# EAGLE design pepperbacon (EAGLE 5.11)
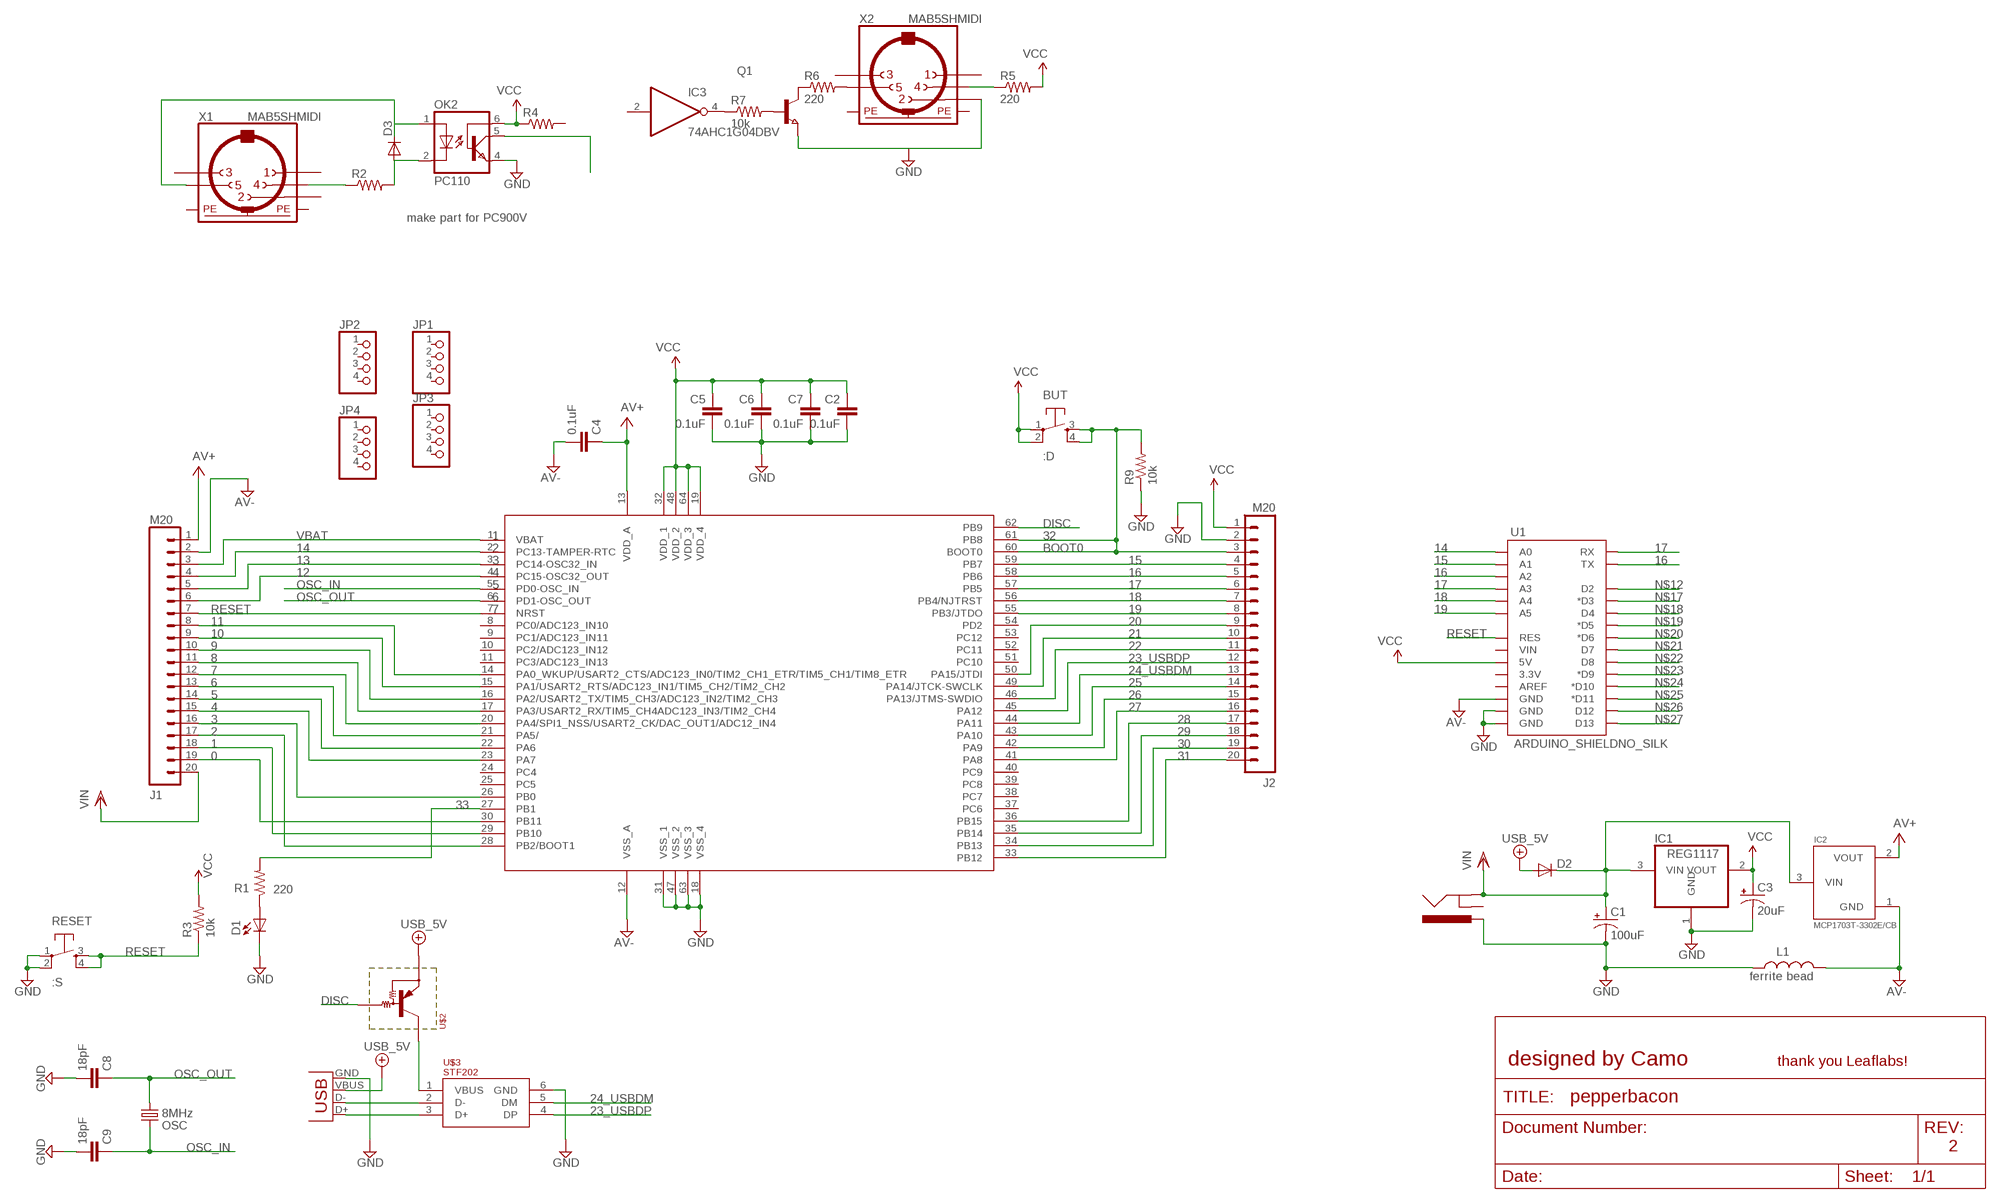
[diagram p0: schematic, sheet 1]

## Parts
BUT  :D  TAC_SWITCHPTH  [TACTILE-PTH]
C1  100uF  CAP_POLPTH2  [CPOL-RADIAL-10UF-25V]
C2  0.1uF  CAP0603  [0603]
C3  20uF  CAP_POLPTH2  [CPOL-RADIAL-10UF-25V]
C4  0.1uF  CAP0603  [0603]
C5  0.1uF  CAP0603  [0603]
C6  0.1uF  CAP0603  [0603]
C7  0.1uF  CAP0603  [0603]
C8  18pF  CAP0603  [0603]
C9  18pF  CAP0603  [0603]
D1  Blue  LED3MM  [LED3MM]
D2  DIODE1N4148  [DIODE-1N4148]
D3  DIODEPTH2  [DOIDE-1N4148]
IC1  REG1117  [SOT223]
IC2  MCP1703T-3302E/CB  MCP1700T  [SOT23]
IC3  74AHC1G04DBV  [SOT23-5]
J1  M20  [1X20]
J2  M20  [1X20]
J3  POWER_JACKPTH  [POWER_JACK_PTH]
JP1  PINHD-1X4  [1X04]
JP2  PINHD-1X4  [1X04]
JP3  PINHD-1X4  [1X04]
JP4  PINHD-1X4  [1X04]
L1  ferrite bead  INDUCTOR0603  [0603]
OK2  PC110  [DIL06]
OSC  8MHz  CRYSTALSMD  [HC49UP]
Q1  NPN-TRANSISTOR_SOT23  [SOT23]
R1  220  RESISTOR0603  [0603]
R2  R-US_R0603  [R0603]
R3  10k  RESISTOR0603  [0603]
R4  R-US_R0603  [R0603]
R5  220  R-US_R0603  [R0603]
R6  220  R-US_R0603  [R0603]
R7  10k  R-US_R0603  [R0603]
R9  10k  RESISTOR0603  [0603]
RESET  :S  TAC_SWITCHPTH  [TACTILE-PTH]
U1  ARDUINO_SHIELDNO_SILK  [DUEMILANOVE_VIAS]
U2  STM32F10XRXT6  [LQFP64]
U$2  PDTA114E  [SOT23]
U$3  STF202  [SOT23-6L]
USB-B  USB-MINIB  USBPTH  [USB-B-PTH]
X1  MAB5SHMIDI  [MIDIFREE]
X2  MAB5SHMIDI  [MIDIFREE]

## Nets
0: J1.19 U2.30(PB11)
1: J1.18 U2.29(PB10)
2: J1.17 U2.28(PB2/BOOT1)
3: J1.16 U2.26(PB0)
4: J1.15 U2.23(PA7)
5: J1.14 U2.22(PA6)
6: J1.13 U2.21(PA5/)
7: J1.12 U2.20(PA4/SPI1_NSS/USART2_CK/DAC_OUT1/ADC12_IN4)
8: J1.11 U2.17(PA3/USART2_RX/TIM5_CH4ADC123_IN3/TIM2_CH4)
9: J1.10 U2.16(PA2/USART2_TX/TIM5_CH3/ADC123_IN2/TIM2_CH3)
10: J1.9 U2.15(PA1/USART2_RTS/ADC123_IN1/TIM5_CH2/TIM2_CH2)
11: J1.8 U2.14(PA0_WKUP/USART2_CTS/ADC123_IN0/TIM2_CH1_ETR/TIM5_CH1/TIM8_ETR)
12: J1.6 U2.4(PC15-OSC32_OUT)
13: J1.5 U2.3(PC14-OSC32_IN)
14: J1.4 U1.A0 U2.2(PC13-TAMPER-RTC)
15: J2.4 U1.A1 U2.59(PB7)
16: J2.5 U1.A2 U1.TX U2.58(PB6)
17: J2.6 U1.A3 U1.RX U2.57(PB5)
18: J2.7 U1.A4 U2.56(PB4/NJTRST)
19: J2.8 U1.A5 U2.55(PB3/JTDO)
20: J2.9 U2.50(PA15/JTDI)
21: J2.10 U2.49(PA14/JTCK-SWCLK)
22: J2.11 U2.46(PA13/JTMS-SWDIO)
23_USBDP: J2.12 U2.45(PA12) U$3.4(DP)
24_USBDM: J2.13 U2.44(PA11) U$3.5(DM)
25: J2.14 U2.43(PA10)
26: J2.15 U2.42(PA9)
27: J2.16 U2.41(PA8)
28: J2.17 U2.36(PB15)
29: J2.18 U2.35(PB14)
30: J2.19 U2.34(PB13)
31: J2.20 U2.33(PB12)
32: BUT.3 BUT.4 J2.3 R9.2 U2.60(BOOT0) U2.61(PB8)
33: R1.2 U2.27(PB1)
+5V/2: D2.A U$2.2(C) USB-B.VBUS ; supply symbol labelled USB_5V
AGND: U1.GND@2(GND) U2.12(VSS_A) ; supply symbol labelled AV-
AV+: C4.1 IC2.2(VOUT) J1.1 U2.13(VDD_A)
AV-: C4.2 IC2.1(GND) J1.2 L1.1
DGND: C1.2(-) C2.2 C3.2(-) C5.2 C6.2 C7.2 C8.2 C9.2 D1.K(C) IC1.1(GND) J2.2 J3.PWR L1.2 OK2.4(EMI) Q1.2(E) R9.1 RESET.1 RESET.2 U1.GND@0(GND) U1.GND@1(GND) U2.18(VSS_4) U2.31(VSS_1) U2.47(VSS_2) U2.63(VSS_3) U$3.6(GND) USB-B.GND X2.2 ; supply symbol labelled GND
DISC: U2.62(PB9) U$2.1(B)
N$2: D1.A R1.1
N$4: R2.1 X1.4
N$5: U$2.3(E) U$3.1(VBUS)
N$6: D3.A OK2.2(C) R2.2
N$7: D3.C OK2.1(A) X1.5
N$8: OK2.5(COL)
N$9: R5.1 X2.4
N$10: R6.2 X2.5
N$11: Q1.3(C) R6.1
N$12: U1.D2
N$13: Q1.1(B) R7.2
N$14: IC3.4(O) R7.1
N$17: U1.D3(*D3)
N$18: U1.D4
N$19: U1.D5(*D5)
N$20: U1.D6(*D6)
N$21: U1.D7
N$22: U1.D8
N$23: U1.D9(*D9)
N$24: U1.D10(*D10)
N$25: U1.D11(*D11)
N$26: U1.D12
N$27: U1.D13
N$59: U$3.2(D-) USB-B.D-
N$60: U$3.3(D+) USB-B.D+
OSC_IN: C9.1 OSC.2 U2.5(PD0-OSC_IN)
OSC_OUT: C8.1 OSC.1 U2.6(PD1-OSC_OUT)
RESET: J1.7 R3.1 RESET.3 RESET.4 U1.RES U2.7(NRST)
VBAT: J1.3 U2.1(VBAT)
VCC: BUT.1 BUT.2 C2.1 C3.1(+) C5.1 C6.1 C7.1 IC1.2(VOUT) J2.1 OK2.6(BAS) R3.2 R4.1 R5.2 U1.5V U2.19(VDD_4) U2.32(VDD_1) U2.48(VDD_2) U2.64(VDD_3)
VIN: C1.1(+) D2.C IC1.3(VIN) IC2.3(VIN) J1.20 J3.GND
Unconnected: IC3.2(I) J3.GNDBREAK JP1.1 JP1.2 JP1.3 JP1.4 JP2.1 JP2.2 JP2.3 JP2.4 JP3.1 JP3.2 JP3.3 JP3.4 JP4.1 JP4.2 JP4.3 JP4.4 R4.2 U1.3.3V U1.AREF U1.VIN U2.8(PC0/ADC123_IN10) U2.9(PC1/ADC123_IN11) U2.10(PC2/ADC123_IN12) U2.11(PC3/ADC123_IN13) U2.24(PC4) U2.25(PC5) U2.37(PC6) U2.38(PC7) U2.39(PC8) U2.40(PC9) U2.51(PC10) U2.52(PC11) U2.53(PC12) U2.54(PD2) X1.1 X1.2 X1.3 X1.PE1(PE) X1.PE2(PE) X2.1 X2.3 X2.PE1(PE) X2.PE2(PE)

## Notes on the sheet
- make part for PC900V
- BOOT0
- designed by Camo | thank you Leaflabs!
- 2

## Power pins joined to a net without a drawn wire
GND: IC3.3(GND)
VCC: IC3.5(VCC)

## Library data of the parts
BUT RESET = 3d2011:TAC_SWITCH: Momentary Switch Button commonly used for reset or general input. Spark Fun Electronics SKU : COM-00097
C1 C3 = SparkFun3:CAP_POL: Capacitor Polarized These are standard SMD and PTH capacitors. Normally 10uF, 47uF, and 100uF in electrolytic and tantalum varieties. Always verify the external diameter of the through hole cap, it varies with capacity, voltage, and manufacturer. The EIA devices should be standard.
C2 C4-C9 = SparkFun:CAP: Capacitor Standard 0603 ceramic capacitor, and 0.1" leaded capacitor.
D1 = SparkFun:LED: LEDs Standard schematic elements and footprints for 5mm, 3mm, 1206, and 0603 sized LEDs. 5mm - Spark Fun Electronics SKU : COM-00529 (and others)
D2 = SparkFun3:DIODE: Diode These are standard reverse protection diodes and small signal diodes. SMA package can handle up to about 1A. SOD-323 can handle about 200mA. What the SOD-323 package when ordering, there are some mfgs out there that are 5-pin packages.
D3 = 3d2011:DIODE: Diode These are standard reverse protection diodes and small signal diodes. SMA package can handle up to about 1A. SOD-323 can handle about 200mA. What the SOD-323 package when ordering, there are some mfgs out there that are 5-pin packages.
IC1 = burr-brown:REG1117: 800mA and 1A Low Dropout (LDO) Positive Regulator 1.8V, 2.5V, 2.85V, 3.3V, 5V, and Adj; MPN: REG1117; OC_FARNELL: 1097566; OC_NEWARK: 14P6981
IC2 = okie:MCP1700T
IC3 = 74xx-little-us:74*1G04: INVERTER Gate
J1 J2 = SparkFun3:M20: This is just like the LOCK variant in that the holes are staggared by 5 mil, but except for the last two holes. They are not altered from the "standard" footprint layout. This is used for a special purpose on the layout of our Graphic LCD Backpack. Make sure you want to use this device before selecting it for you project!
J3 = 3d2011:POWER_JACK: Power Jack This is the standard 5.5mm barrel jack for power. The PTH is the most common, proven, reliable, footprint. All others are experimental. The Slot footprint only works if the mill layer is transmitted to the PCB fab house so be warned. Spark Fun Electronics SKU : PRT-00119. Mating wall wart : TOL-00298 (and others)
JP1-JP4 = 3d2011:PINHD-1X4: PIN HEADER
L1 = SparkFun3:INDUCTOR: Inductors Basic Inductor/Choke - 0603 and 1206. Footprints are not proven and vary greatly between part numbers.
OK2 = optocoupler:PC110: SHARP OPTO COUPLER
OSC = SparkFun2:CRYSTAL: Crystals Various standard crystals. Proven footprints. Spark Fun Electronics SKU : COM-00534
Q1 = semicon-smd-ipc:NPN-TRANSISTOR_: NPN TRANSISTOR
R1 R3 R9 = SparkFun:RESISTOR: Resistor Basic schematic elements and footprints for 0603, 1206, and PTH 1/10th watt (small) resistors.
R2 R4-R7 = resistor:R-US_: RESISTOR, American symbol
U1 = SparkFun:ARDUINO_SHIELD
U2 = stm32:STM32F10XRXT6: STM32F101/103 64pin LQFP
U$2 = bacon:PDTA114E: Transistor with matching resistors (pre biased). Digikey #568-8088-1-ND
U$3 = bacon:STF202: The STF202 is a combination EMI filter and line termination device with integrated TVS diodes for use on upstream USB ports. Digikey Part #STF202-22T1GOSCT-ND
USB-B = SparkFun2:USB: USB Connectors USB-B-PTH is fully proven SKU : PRT-00139 USB-miniB is fully proven SKU : PRT-00587 USB-A-PCB is untested. USB-A-H is throughly reviewed, but untested. Spark Fun Electronics SKU : PRT-00437 USB-B-SMT is throughly reviewed, but untested. Needs silkscreen touching up. USB-A-S has not been used/tested USB-MB-H has not been used/tested
X1 X2 = 3d2011:MAB5SH: Female CONNECTOR 5 pins 90 deg. with shield, horizontal (DIN 41524)

## Net classes
1 vcc: width 0.254 mm

## Board
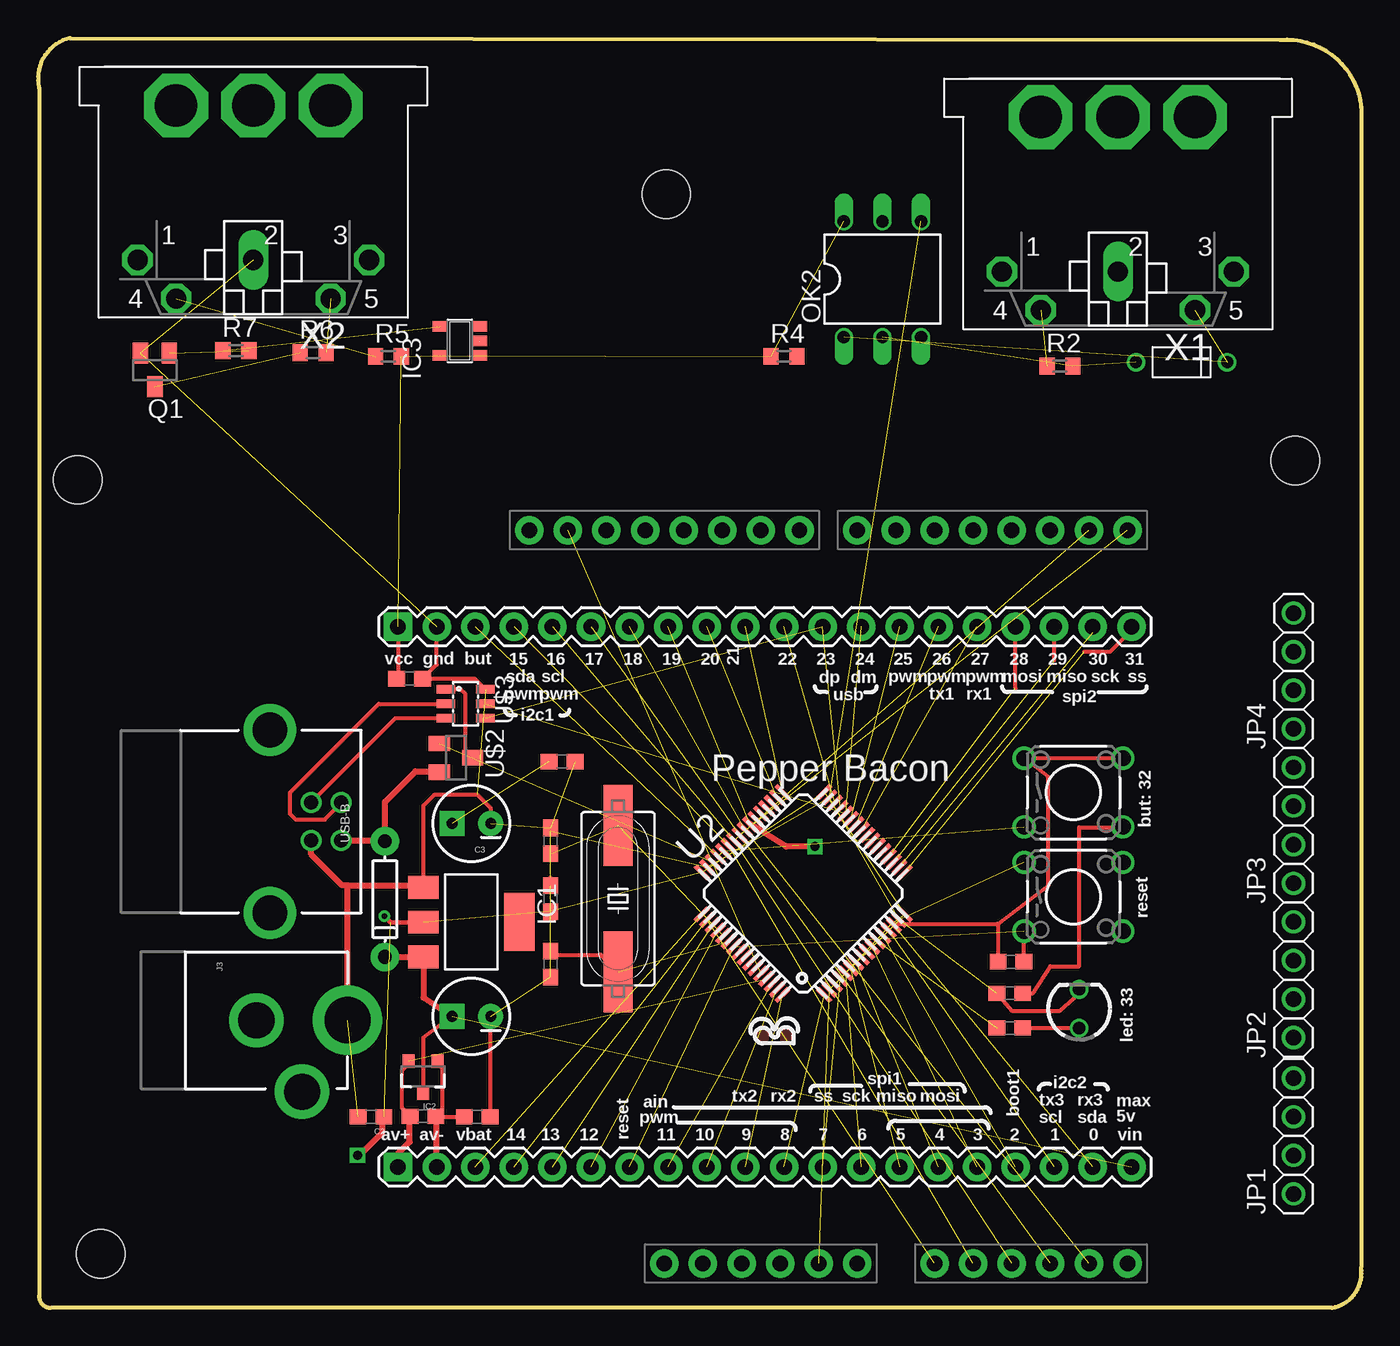
[diagram p1: board, top side]
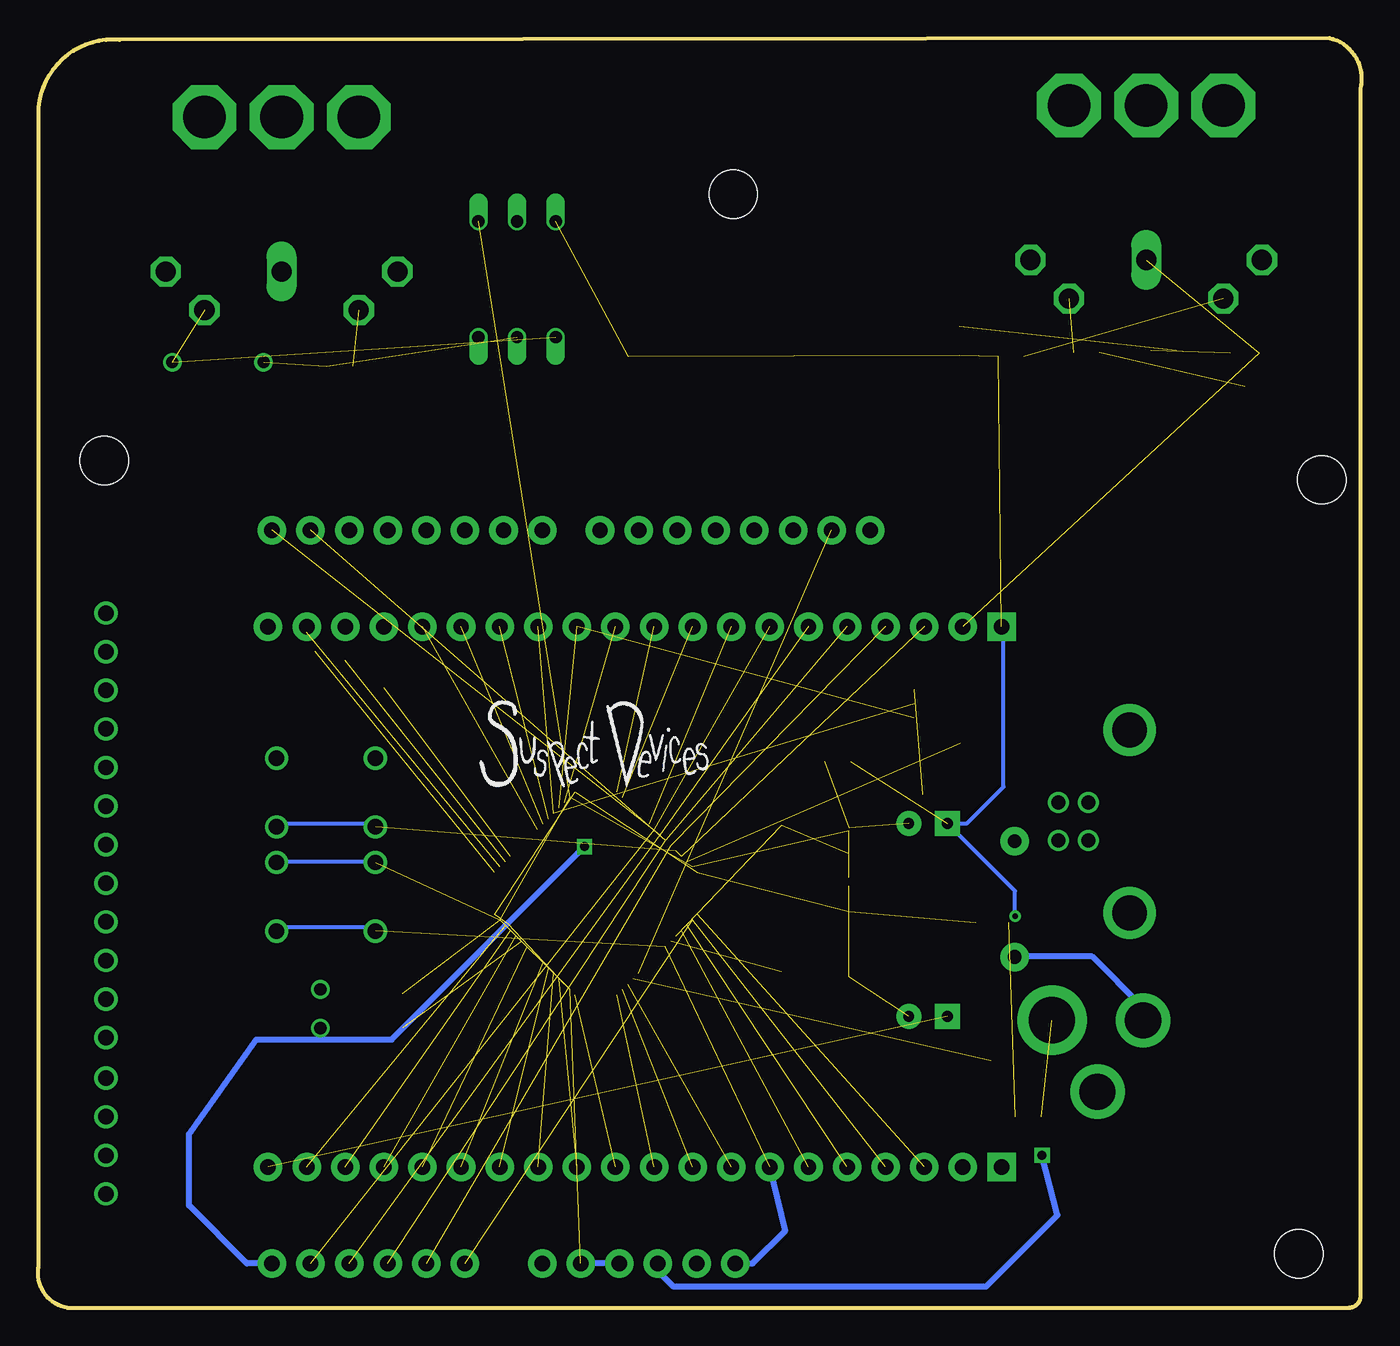
[diagram p2: board, bottom side, seen from below]

Size 87.1 x 83.57 mm. Coordinates in mm from the lower left corner, seen from the top.
Outline: 2.1,83.57 81.73,83.44 arc-90 87.07,78.99 87.07,2.67 arc-90 85.16,0 0.83,0 arc-90 0.07,0.76 0.07,80.26 arc-90 2.1,83.57
Copper layers (1*16): Top 0.0178mm / dielectric 1.4986mm / Bottom 0.0178mm
Design rules "SSC-EAGLE-2Lyr_v1.0.0.3": minimum track width 6mil, minimum drill 14mil, track to track 6mil, track to pad 6mil, pad to pad 6mil, via to via 6mil, smd to smd 6mil, copper to edge 20mil, drill to drill 16mil, minimum pad ring 8mil, minimum via ring 8mil, stop-mask expansion 3mil, vias tented up to drill 0mil, thermal gap 10mil
Holes 3.17 mm at 2.61,54.48 4.14,3.56 82.75,55.75 41.35,73.28

### Footprints (pad centres in the part's own frame; a part is rotated, then mirrored left to right if it is on the bottom)
TACTILE-PTH = drill 1.016 round: 1 -3.251,2.261; 2 3.251,2.261; 3 -3.251,-2.261; 4 3.251,-2.261
CPOL-RADIAL-10UF-25V = drill 0.7 pad 1.651 square: 1 1.27,0 | drill 0.7 pad 1.651 round: 2 -1.27,0
0603 = smd 1.1 x 1: 1 -0.85,0; 2 0.85,0
LED3MM = drill 0.813 round: A -1.27,0; K 1.27,0
DIODE-1N4148 = drill 0.9 pad 1.88 round: A -3.81,0; C 3.81,0
DOIDE-1N4148 = drill 0.8 round: A 3,0; C -3,0
SOT223 = smd 1.499 x 2.007: 1 -2.261,-3.15; 2 0.025,-3.15; 3 2.311,-3.15 | smd 3.81 x 2.007: 4 0,3.15
SOT23 = smd 0.8 x 0.9: 1 -0.95,-1; 2 0.95,-1; 3 0,1.1
SOT23-5 = smd 0.69 x 0.99: 1 -0.95,-1.29; 2 0,-1.29; 3 0.95,-1.29; 4 0.95,1.3; 5 -0.95,1.3
1X20 = drill 1.016 pad 1.88 square: 1 0,0 | drill 1.016 pad 1.88 round: 2 2.54,0; 3 5.08,0; 4 7.62,0; 5 10.16,0; 6 12.7,0; 7 15.24,0; 8 17.78,0; 9 20.32,0; 10 22.86,0; 11 25.4,0; 12 27.94,0; 13 30.48,0; 14 33.02,0; 15 35.56,0; 16 38.1,0; 17 40.64,0; 18 43.18,0; 19 45.72,0; 20 48.26,0
POWER_JACK_PTH = drill 2.381 round: GND 0,7.7; GNDBREAK 4.7,10.7 | drill 3.048 round: PWR 0,13.7
1X04 = drill 1.016 round: 1 -3.81,0; 2 -1.27,0; 3 1.27,0; 4 3.81,0
DIL06 = drill 0.813 offset: 1 -2.54,-3.81; 2 0,-3.81; 3 2.54,-3.81; 4 2.54,3.81; 5 0,3.81; 6 -2.54,3.81
HC49UP = smd 5.334 x 1.93: 1 -4.826,0; 2 4.826,0
SOT23' = smd 1 x 1.4: 1 -0.95,-1.1; 2 0.95,-1.1; 3 0,1.1
R0603 = smd 1 x 1.1: 1 -0.85,0; 2 0.85,0
DUEMILANOVE_VIAS = drill 1.016 pad 1.88 round: 3.3V 50.8,13.97; 5V 50.8,16.51; A0 50.8,29.21; A1 50.8,31.75; A2 50.8,34.29; A3 50.8,36.83; A4 50.8,39.37; A5 50.8,41.91; AREF 2.54,2.54; D2 2.54,36.83; D3 2.54,34.29; D4 2.54,31.75; D5 2.54,29.21; D6 2.54,26.67; D7 2.54,24.13; D8 2.54,20.32; D9 2.54,17.78; D10 2.54,15.24; D11 2.54,12.7; D12 2.54,10.16; D13 2.54,7.62; GND@0 50.8,19.05; GND@1 50.8,21.59; GND@2 2.54,5.08; RES 50.8,11.43; RX 2.54,41.91; TX 2.54,39.37; VIN 50.8,24.13
LQFP64 = smd 1.2 x 0.3: 1 0.65,10.1; 2 0.65,9.6; 3 0.65,9.1; 4 0.65,8.6; 5 0.65,8.1; 6 0.65,7.6; 7 0.65,7.1; 8 0.65,6.6; 9 0.65,6.1; 10 0.65,5.6; 11 0.65,5.1; 12 0.65,4.6; 13 0.65,4.1; 14 0.65,3.6; 15 0.65,3.1; 16 0.65,2.6; 33 12.05,2.6; 34 12.05,3.1; 35 12.05,3.6; 36 12.05,4.1; 37 12.05,4.6; 38 12.05,5.1; 39 12.05,5.6; 40 12.05,6.1; 41 12.05,6.6; 42 12.05,7.1; 43 12.05,7.6; 44 12.05,8.1; 45 12.05,8.6; 46 12.05,9.1; 47 12.05,9.6; 48 12.05,10.1 | smd 0.3 x 1.2: 17 2.6,0.65; 18 3.1,0.65; 19 3.6,0.65; 20 4.1,0.65; 21 4.6,0.65; 22 5.1,0.65; 23 5.6,0.65; 24 6.1,0.65; 25 6.6,0.65; 26 7.1,0.65; 27 7.6,0.65; 28 8.1,0.65; 29 8.6,0.65; 30 9.1,0.65; 31 9.6,0.65; 32 10.1,0.65; 49 10.1,12.05; 50 9.6,12.05; 51 9.1,12.05; 52 8.6,12.05; 53 8.1,12.05; 54 7.6,12.05; 55 7.1,12.05; 56 6.6,12.05; 57 6.1,12.05; 58 5.6,12.05; 59 5.1,12.05; 60 4.6,12.05; 61 4.1,12.05; 62 3.6,12.05; 63 3.1,12.05; 64 2.6,12.05
SOT23-6L = smd 0.55 x 1.2: 1 -0.95,-1.3; 2 0,-1.3; 3 0.95,-1.3; 4 0.95,1.3; 5 0,1.3; 6 -0.95,1.3
USB-B-PTH = drill 0.914 round: D+ 0,1.25; D- 1.981,1.25; GND 0,-1.25; VBUS 1.981,-1.25 | drill 2.286 round: P$1 -2.718,-6.02; P$2 -2.718,6.02
MIDIFREE = drill 1.321 octagon: 1 7.62,3.81; 3 -7.62,3.81; 4 5.08,6.35; 5 -5.08,6.35 | drill 1.321 long: 2 0,3.81 | drill 2.8 octagon: PE1 0,-6.35; PE2 -5.08,-6.35; PE3 5.08,-6.35

### Placement (x,y rotation side)
BUT  68.14,33.91 0 top
C1  28.52,19.18 180 top
C2  21.92,12.57 180 top
C3  28.52,31.88 180 top
C4  25.33,12.61 0 top
C5  33.73,26.92 90 top
C6  24.46,41.4 0 top
C7  34.49,35.94 0 top
C8  33.73,22.62 270 top
C9  33.73,30.73 90 top
D1  68.52,19.68 90 top
D2  22.83,26.9 270 top
D3  75.26,62.23 180 top
IC1  28.52,25.4 270 top
IC2  25.34,15.24 180 top
IC3  27.76,63.63 90 top
J1  23.69,9.27 0 top
J2  23.69,44.83 0 top
J3  6.68,18.92 270 top
JP1  82.62,11.3 90 top
JP2  82.62,21.59 90 top
JP3  82.62,31.75 90 top
JP4  82.62,41.91 90 top
L1  28.9,12.57 0 top
OK2  55.57,67.69 0 top
OSC  38.17,26.92 90 top
Q1  [SOT23']  7.69,61.72 180 top
R1  63.95,18.41 180 top
R2  67.25,61.98 0 top
R3  64.03,22.78 180 top
R4  49.09,62.61 0 top
R5  23.06,62.61 0 top
R6  18.11,62.87 0 top
R7  13.03,62.99 0 top
R9  63.95,20.7 0 top
RESET  68.14,27.05 0 top
U1  29.79,53.72 270 top
U2  50.36,18.29 45 top
U$1  [SUSDEVLOGOSM]  58.11,34.54 0 bottom
U$2  PDTA114E  [SOT23']  27.5,36.2 270 top
U$3  28.14,39.75 270 top
USB-B  17.98,32 0 top
X1  71.06,72.01 180 top
X2  14.17,72.77 180 top

### Tracks (layer width: path | path; a pad name or v marks a point on that pad's centre or on a via)
0  (1 unrouted)
1  (1 unrouted)
2  (1 unrouted)
3  (1 unrouted)
4  (1 unrouted)
5  (1 unrouted)
6  (1 unrouted)
7  (1 unrouted)
8  (1 unrouted)
9  (1 unrouted)
10  (1 unrouted)
11  (1 unrouted)
12  (1 unrouted)
13  (1 unrouted)
14  (2 unrouted)
15  (2 unrouted)
16  (3 unrouted)
17  (3 unrouted)
18  (2 unrouted)
19  (via drill 0.6)  (1 unrouted)
  Top 0.406: v51.13,30.35 49.23,30.35 U2.55
  Bottom 0.406: U1.A5 73.35,2.92 77.16,6.73 77.16,11.43 72.72,17.65 63.83,17.65 v51.13,30.35
20  (1 unrouted)
21  (1 unrouted)
22  (1 unrouted)
23_USBDP  (2 unrouted)
24_USBDM  (2 unrouted)
25  (1 unrouted)
26  (1 unrouted)
27  (1 unrouted)
28  (1 unrouted)
  Top 0.254: 64.33,40.78 J2.17
29  (1 unrouted)
  Top 0.254: 66.87,42.61 J2.18
30  (1 unrouted)
  Top 0.254: J2.19 69.41,44.44
31  (1 unrouted)
  Top 0.254: 68.86,43.18 70.56,43.18 71.95,44.58 J2.20
32  (3 unrouted)
  Top 0.254: R9.2 65.48,20.7 66.62,22.48 68.52,22.48 68.52,31.62 71.37,31.62 BUT.4
  Bottom 0.254: BUT.3 64.97,31.88 71.32,31.88 BUT.4
33  (1 unrouted)
+5V/2
  Top 0.254: 22.78,30.75 D2.A | 26.34,35.31 U$2.2
  Top 0.406: USB-B.VBUS 22.78,30.75 | D2.A 22.83,33.3 24.84,35.31 26.34,35.31
AGND  (1 unrouted)
AV+  (1 unrouted)
  Top 0.254: IC2.2 24.39,16.07 23.95,15.62 23.95,13.14 C4.1
  Top 0.406: J1.1 23.69,10.16 24.46,10.92 24.46,12.59 C4.1
AV-
  Top 0.254: IC2.1 26.29,16.07 26.61,15.75 26.61,13.04 C4.2 26.22,12.57 L1.1
  Top 0.406: J1.2 26.23,12.56 C4.2
DGND  (17 unrouted)
  Top 0.254: D1.K 68.52,20.7 67.25,19.56 64.08,19.56 R9.1 | C5.2 33.73,28.32 | C9.2 33.73,31.37 | J2.2 26.23,42.33 C6.2 28.74,41.4 U$3.6 | 25.22,27.81 IC1.1 25.37,33.05 26.11,33.78 28.9,33.78 29.79,32.89 C3.2 | 20.38,27.8 20.39,27.81 | C1.2 29.79,12.61 L1.2
  Top 0.406: USB-B.GND 17.98,29.84 20.01,27.81 20.39,27.81 25.22,27.81 | J3.PWR 20.38,27.8
  Bottom 0.254: RESET.1 64.97,29.34 71.32,29.34 RESET.2
  Bottom 0.406: U1.GND@0 U1.GND@1
DISC  (1 unrouted)
N$1
  pour Top: 47.7,17.65 arc-90 47.44,17.91 arc-90 47.7,18.16 47.82,18.16 arc-90 47.95,18.03 47.95,17.65
N$2
  Top 0.254: R1.1 D1.A
N$3
  pour Top: 49.35,17.65 arc90 49.47,17.78 49.47,18.03 arc90 49.35,18.16 49.09,18.16 arc90 48.97,18.03 48.97,17.65
N$4  (1 unrouted)
N$5
  Top 0.254: U$3.1 27.82,40.7 28.14,40.39 28.14,36.24 U$2.3
N$6  (2 unrouted)
N$7  (2 unrouted)
N$9  (1 unrouted)
N$10  (1 unrouted)
N$11  (1 unrouted)
N$13  (1 unrouted)
N$14  (1 unrouted)
N$59
  Top 0.254: USB-B.D- 19.96,33.22 18.87,32.13 16.96,32.13 16.58,32.51 16.58,33.91 22.42,39.75 U$3.2
N$60
  Top 0.254: U$3.3 23.53,38.8 USB-B.D+
OSC_IN  (2 unrouted)
OSC_OUT  (1 unrouted)
  Top 0.254: C8.1 33.73,23.24 37.03,23.24 OSC.1
RESET  (2 unrouted)
  Top 0.254: R3.1 64.89,22.8 RESET.3
  Bottom 0.254: RESET.4 71.32,25.02 64.97,25.02 RESET.3
  Bottom 0.406: U1.RES 40.08,2.92 37.92,5.08 J1.7
VBAT  (1 unrouted)
VCC  (via drill 0.36, 0.6)  (12 unrouted)
  Top 0.254: BUT.2 71.32,36.2 64.97,36.2 BUT.1 66.49,34.92 66.49,27.81 63.16,25.28 | 63.16,25.28 R3.2 | 56.15,25.28 63.16,25.28 | J2.1 23.69,41.49 C6.1
  Top 0.305: IC1.2 23.21,25.38 v22.8,25.78
  Top 0.406: v21.03,10.03 21.15,10.03 22.68,11.56 22.68,12.48 C2.1
  Bottom 0.254: J2.1 23.57,44.7 23.57,34.29 25.98,31.88 C3.1 22.8,27.43 v22.8,25.78
  Bottom 0.406: U1.5V 46.3,2.41 45.28,1.4 24.71,1.4 20.01,6.1 v21.03,10.03
VIN  (1 unrouted)
  Top 0.254: IC2.3 25.34,17.78 C1.1
  Top 0.406: D2.C IC1.3 25.37,20.42 C1.1
  Bottom 0.254: 22.8,23.11 D2.C
  Bottom 0.406: J3.GND 14.38,19.77 17.72,23.11 22.8,23.11

### Text on the board
tNames: vcc | gnd | but | 15 | 16 | 17 | 18 | 19 | 20 | 21 | 22 | 23 | dp | 24 | dm | 25 | 26 | 27 | 28 | 29 | 30 | 31 | sda | scl | usb | pwm | pwm | pwm | mosi | miso | sck | spi2 | ss | pwm | pwm | tx1 | rx1 | i2c1 | Pepper Bacon | but: 32 | reset | led: 33 | boot1 | spi1 | tx2 | rx2 | ss | sck | miso | mosi | i2c2 | ain | tx3 | rx3 | max | pwm | scl | sda | 5v | av+ | av- | vbat | 14 | 13 | 12 | reset | 11 | 10 | 9 | 8 | 7 | 6 | 5 | 4 | 3 | 2 | 1 | 0 | vin